# Altium schematic sheet LMS7_FE.SchDoc: XTRX. SDR mini PCIe Transceiver.
size A3; CompanyName: Fairwaves Inc.; DrawnBy: Andrey Sviyazov; Revision: 4; SheetNumber: 5; SheetTotal: 5
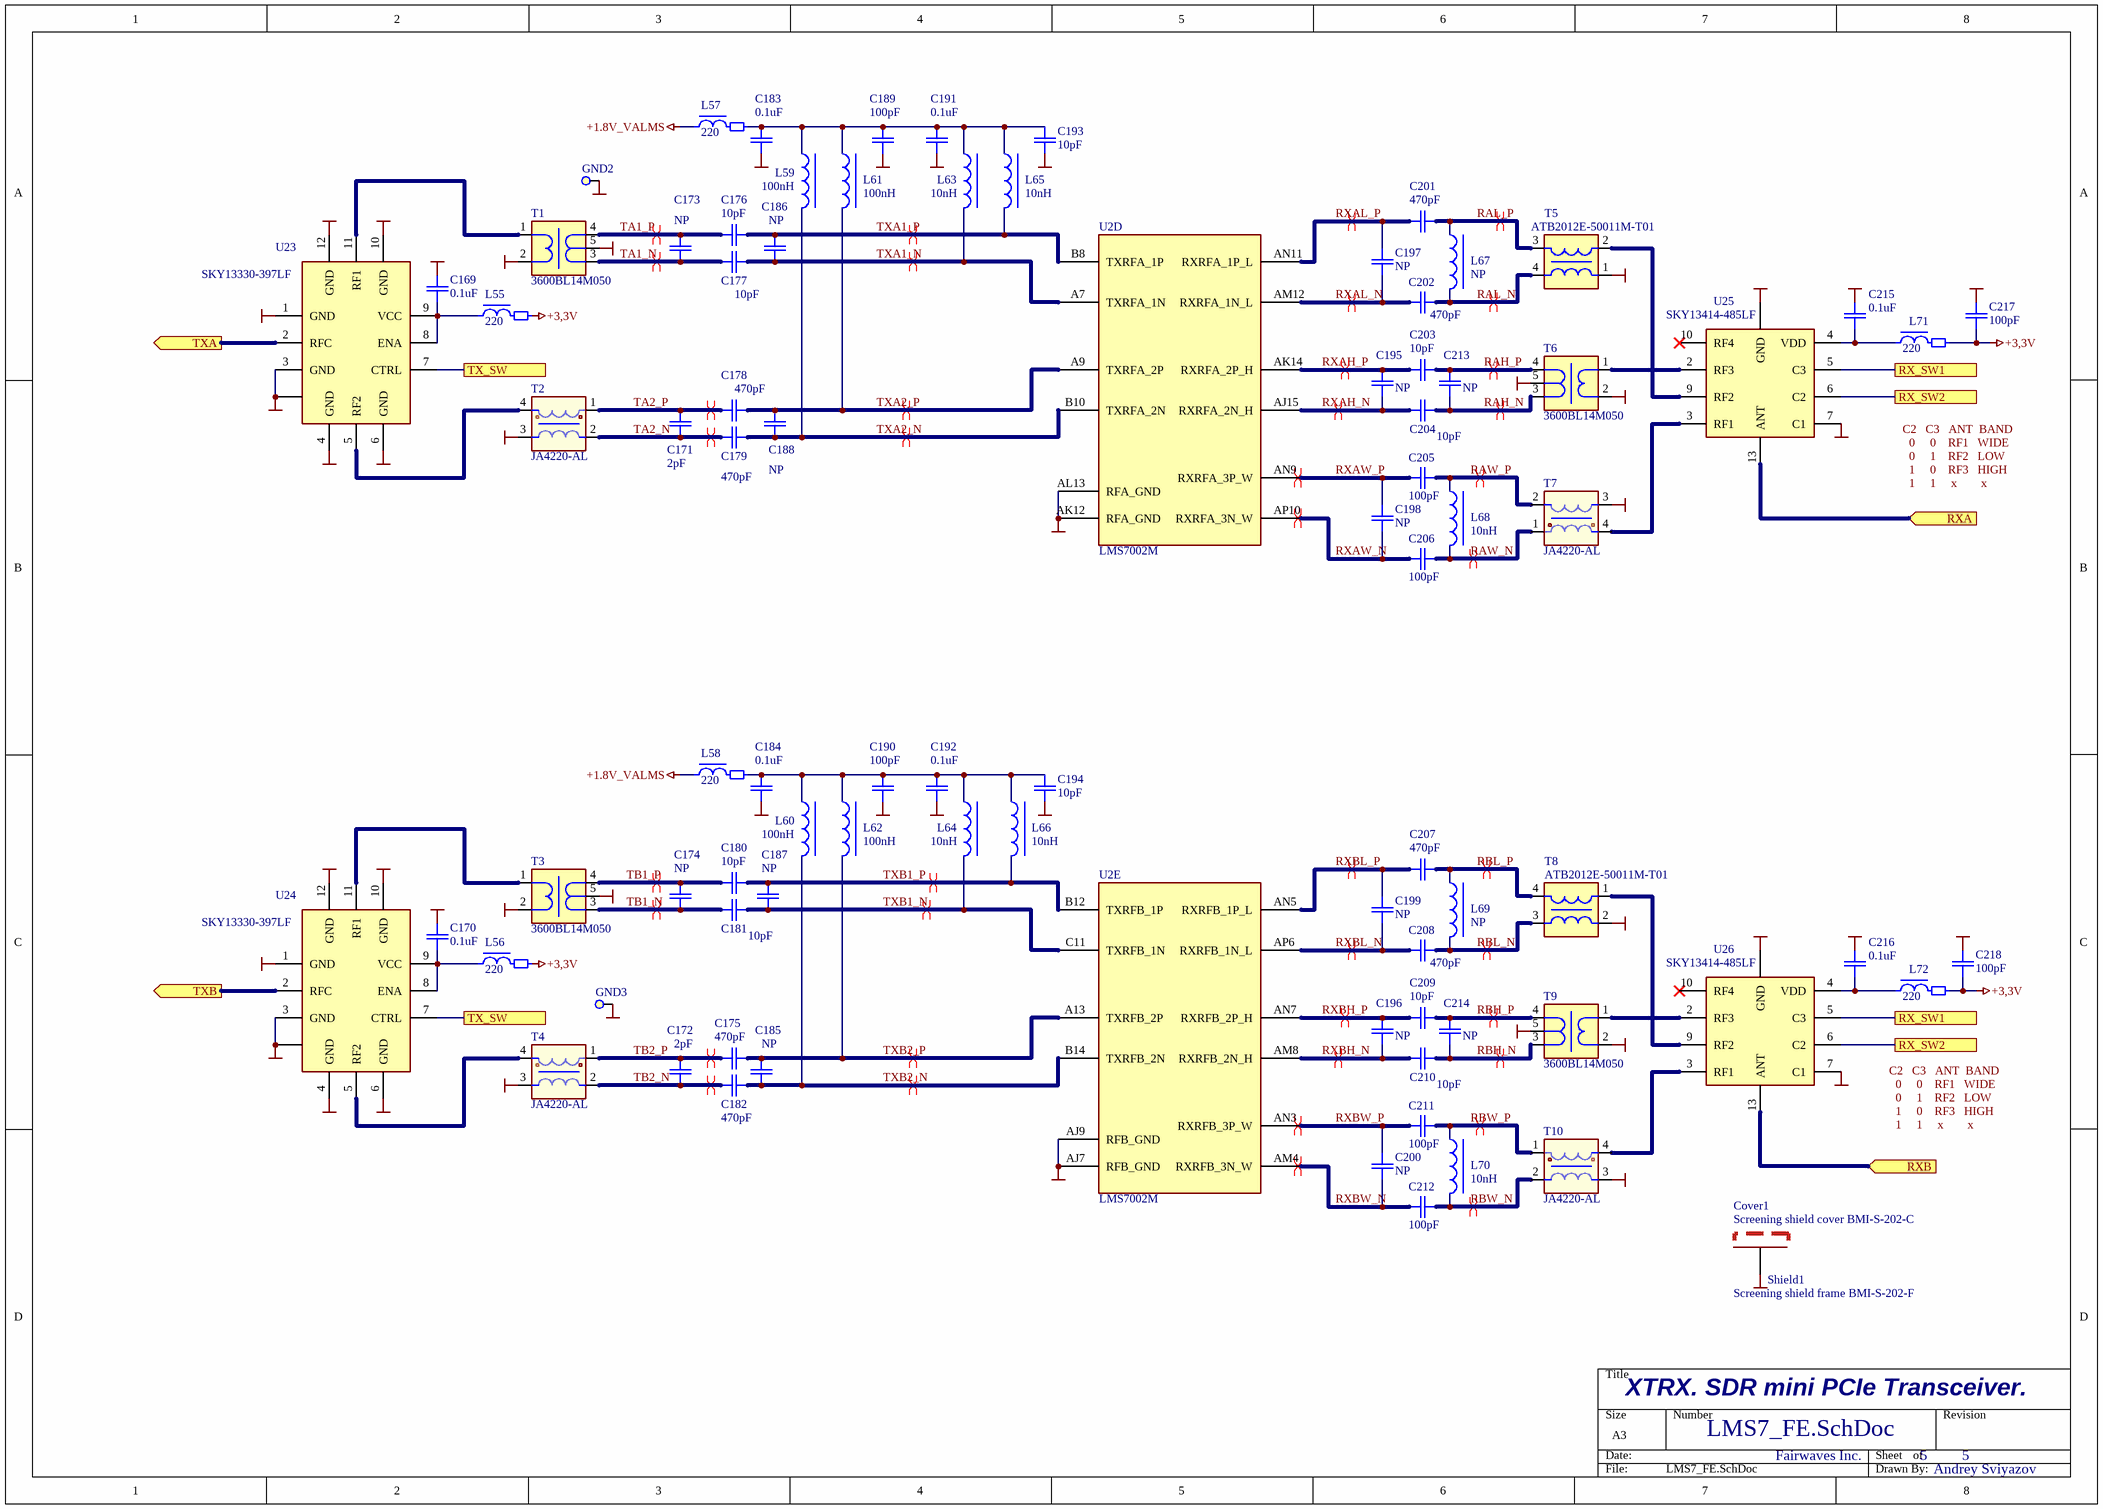
[diagram p0: LMS7_FE.SchDoc]

## Parts
C169  0.1uF  [C0402-cirq]
C170  0.1uF  [C0402-cirq]
C171  2pF  [C0402-cirq]
C172  2pF  [C0402-cirq]
C173  NP  [C0402-cirq]
C174  NP  [C0402-cirq]
C175  470pF  [C0402-cirq]
C176  10pF  [C0402-cirq]
C177  10pF  [C0402-cirq]
C178  470pF  [C0402-cirq]
C179  470pF  [C0402-cirq]
C180  10pF  [C0402-cirq]
C181  10pF  [C0402-cirq]
C182  470pF  [C0402-cirq]
C183  0.1uF  [C0402-cirq]
C184  0.1uF  [C0402-cirq]
C185  NP  [C0402-cirq]
C186  NP  [C0402-cirq]
C187  NP  [C0402-cirq]
C188  NP  [C0402-cirq]
C189  100pF  [C0402-cirq]
C190  100pF  [C0402-cirq]
C191  0.1uF  [C0402-cirq]
C192  0.1uF  [C0402-cirq]
C193  10pF  [C0402-cirq]
C194  10pF  [C0402-cirq]
C195  NP  [C0402-cirq]
C196  NP  [C0402-cirq]
C197  NP  [C0402-cirq]
C198  NP  [C0402-cirq]
C199  NP  [C0402-cirq]
C200  NP  [C0402-cirq]
C201  470pF  [C0402-cirq]
C202  470pF  [C0402-cirq]
C203  10pF  [C0402-cirq]
C204  10pF  [C0402-cirq]
C205  100pF  [C0402-cirq]
C206  100pF  [C0402-cirq]
C207  470pF  [C0402-cirq]
C208  470pF  [C0402-cirq]
C209  10pF  [C0402-cirq]
C210  10pF  [C0402-cirq]
C211  100pF  [C0402-cirq]
C212  100pF  [C0402-cirq]
C213  NP  [C0402-cirq]
C214  NP  [C0402-cirq]
C215  0.1uF  [C0402-cirq]
C216  0.1uF  [C0402-cirq]
C217  100pF  [C0402-cirq]
C218  100pF  [C0402-cirq]
Cover1  Screening shield cover BMI-S-202-C  (mechanical)
GND2  (no value)  [KP D1.5mm]  (no BOM)
GND3  (no value)  [KP D1.5mm]  (no BOM)
L55  220  [BEAD0402-Phillips]
L56  220  [BEAD0402-Phillips]
L57  220  [BEAD0402-Phillips]
L58  220  [BEAD0402-Phillips]
L59  100nH  [COIL0402-Phillips]
L60  100nH  [COIL0402-Phillips]
L61  100nH  [COIL0402-Phillips]
L62  100nH  [COIL0402-Phillips]
L63  10nH  [COIL0402-Phillips]
L64  10nH  [COIL0402-Phillips]
L65  10nH  [COIL0402-Phillips]
L66  10nH  [COIL0402-Phillips]
L67  NP  [COIL0402-Phillips]
L68  10nH  [COIL0402-Phillips]
L69  NP  [COIL0402-Phillips]
L70  10nH  [COIL0402-Phillips]
L71  220  [BEAD0402-Phillips]
L72  220  [BEAD0402-Phillips]
Shield1  Screening shield frame BMI-S-202-F  [BMI-S-202-F]
T1  3600BL14M050  [Balun 1.6x0.8x0.6mm]
T2  JA4220-AL  [JA4220-AL]
T3  3600BL14M050  [Balun 1.6x0.8x0.6mm]
T4  JA4220-AL  [JA4220-AL]
T5  ATB2012E-50011M-T01  [Balun 1.2x2x1mm]
T6  3600BL14M050  [Balun 1.6x0.8x0.6mm]
T7  JA4220-AL  [JA4220-AL]
T8  ATB2012E-50011M-T01  [Balun 1.2x2x1mm]
T9  3600BL14M050  [Balun 1.6x0.8x0.6mm]
T10  JA4220-AL  [JA4220-AL]
U2  LMS7002M  [aQFN260(11.5x11.5mm)]  (parts D,E of 5)
U23  SKY13330-397LF  [QFN12(2x2/0.5)]
U24  SKY13330-397LF  [QFN12(2x2/0.5)]
U25  SKY13414-485LF  [QFN14(2x2/0.4-0.45)]
U26  SKY13414-485LF  [QFN14(2x2/0.4-0.45)]

## Ports
RX_SW1, RX_SW2, RXA (in), RXB (in), TX_SW, TXA (out), TXB (out)

## Nets
+1.8V_VALMS: L57.1 L58.1
+3,3V: C217.1 C218.1 L55.2 L56.2 L71.2 L72.2
GND: C169.2 C170.2 C183.2 C184.2 C189.2 C190.2 C191.2 C192.2 C193.1 C194.1 C215.1 C216.1 C217.2 C218.2 GND2.1 GND3.1 Shield1.0(GND) T1.2 T1.5 T2.3(Pri) T3.2 T3.5 T4.3(Pri) T5.1 T6.2 T6.5 T7.3(Pri) T8.2 T9.2 T9.5 T10.3(Pri) U2.AJ7(RFB_GND) U2.AJ9(RFB_GND) U2.AK12(RFA_GND) U2.AL13(RFA_GND) U23.0 U23.1(GND) U23.3(GND) U23.4(GND) U23.6(GND) U23.10(GND) U23.12(GND) U24.0 U24.1(GND) U24.3(GND) U24.4(GND) U24.6(GND) U24.10(GND) U24.12(GND) U25.0(GND) U25.7(C1) U26.0(GND) U26.7(C1)
RAH_N: C204.2 C213.1 T6.3
RAH_P: C203.2 C213.2 T6.4
RAL_N: C202.1 L67.2 T5.4
RAL_P: C201.1 L67.1 T5.3
RAW_N: C206.2 L68.2 T7.1(Sec)
RAW_P: C205.2 L68.1 T7.2(Sec_Dot)
RBH_N: C210.2 C214.1 T9.3
RBH_P: C209.2 C214.2 T9.4
RBL_N: C208.1 L69.2 T8.3
RBL_P: C207.1 L69.1 T8.4
RBW_N: C212.2 L70.2 T10.2(Sec_Dot)
RBW_P: C211.2 L70.1 T10.1(Sec)
RX_SW1: U25.5(C3) U26.5(C3) ; port RX_SW1
RX_SW2: U25.6(C2) U26.6(C2) ; port RX_SW2
RXA: U25.13(ANT) ; port RXA
RXAH_N: C195.1 C204.1 U2.AJ15(RXRFA_2N_H)
RXAH_P: C195.2 C203.1 U2.AK14(RXRFA_2P_H)
RXAL_N: C197.1 C202.2 U2.AM12(RXRFA_1N_L)
RXAL_P: C197.2 C201.2 U2.AN11(RXRFA_1P_L)
RXAW_N: C198.1 C206.1 U2.AP10(RXRFA_3N_W)
RXAW_P: C198.2 C205.1 U2.AN9(RXRFA_3P_W)
RXB: U26.13(ANT) ; port RXB
RXBH_N: C196.1 C210.1 U2.AM8(RXRFB_2N_H)
RXBH_P: C196.2 C209.1 U2.AN7(RXRFB_2P_H)
RXBL_N: C199.1 C208.2 U2.AP6(RXRFB_1N_L)
RXBL_P: C199.2 C207.2 U2.AN5(RXRFB_1P_L)
RXBW_N: C200.2 C212.1 U2.AM4(RXRFB_3N_W)
RXBW_P: C200.1 C211.1 U2.AN3(RXRFB_3P_W)
TA1_N: C173.2 C177.1 T1.3
TA1_P: C173.1 C176.1 T1.4
TA2_N: C171.2 C179.2 T2.2(Sec_Dot)
TA2_P: C171.1 C178.2 T2.1(Sec)
TB1_N: C174.1 C181.1 T3.3
TB1_P: C174.2 C180.1 T3.4
TB2_N: C172.1 C182.2 T4.2(Sec_Dot)
TB2_P: C172.2 C175.2 T4.1(Sec)
TX_SW: U23.7(CTRL) U24.7(CTRL) ; port TX_SW
TXA: U23.2(RFC) ; port TXA
TXA1_N: C177.2 C186.2 L63.2 U2.A7(TXRFA_1N)
TXA1_P: C176.2 C186.1 L65.2 U2.B8(TXRFA_1P)
TXA2_N: C179.1 C188.2 L59.2 U2.B10(TXRFA_2N)
TXA2_P: C178.1 C188.1 L61.2 U2.A9(TXRFA_2P)
TXB: U24.2(RFC) ; port TXB
TXB1_N: C181.2 C187.1 L64.2 U2.C11(TXRFB_1N)
TXB1_P: C180.2 C187.2 L66.2 U2.B12(TXRFB_1P)
TXB2_N: C182.1 C185.1 L60.2 U2.B14(TXRFB_2N)
TXB2_P: C175.1 C185.2 L62.2 U2.A13(TXRFB_2P)
NetC169_1: C169.1 L55.1 U23.8(ENA) U23.9(VCC)
NetC170_1: C170.1 L56.1 U24.8(ENA) U24.9(VCC)
NetC183_1: C183.1 C189.1 C191.1 C193.2 L57.2 L59.1 L61.1 L63.1 L65.1
NetC184_1: C184.1 C190.1 C192.1 C194.2 L58.2 L60.1 L62.1 L64.1 L66.1
NetC215_2: C215.2 L71.1 U25.4(VDD)
NetC216_2: C216.2 L72.1 U26.4(VDD)
NetT1_1: T1.1 U23.11(RF1)
NetT2_4: T2.4(Pri_Dot) U23.5(RF2)
NetT3_1: T3.1 U24.11(RF1)
NetT4_4: T4.4(Pri_Dot) U24.5(RF2)
NetT5_2: T5.2 U25.9(RF2)
NetT6_1: T6.1 U25.2(RF3)
NetT7_4: T7.4(Pri_Dot) U25.3(RF1)
NetT8_1: T8.1 U26.9(RF2)
NetT9_1: T9.1 U26.2(RF3)
NetT10_4: T10.4(Pri_Dot) U26.3(RF1)

Not connected (* = marked no-connect by the designer): U25 10(RF4)*; U26 10(RF4)*

## Layout directives
differential pair: RAH_N, RAH_P, RAL_N, RAL_P, RAW_N, RAW_P, RBH_N, RBH_P, RBL_N, RBL_P, RBW_N, RBW_P, RXAH_N, RXAH_P, RXAL_N, RXAL_P, RXAW_N, RXAW_P, RXBH_N, RXBH_P, RXBL_N, RXBL_P, RXBW_N, RXBW_P, TA1_N, TA1_P, TA2_N, TA2_P, TB1_N, TB1_P, TB2_N, TB2_P, TXA1_N, TXA1_P, TXA2_N, TXA2_P, TXB1_N, TXB1_P, TXB2_N, TXB2_P

## Notes on the sheet
- C2   C3   ANT  BAND
- 0     0    RF1   WIDE
- 0     1    RF2   LOW
- 1     0    RF3   HIGH
- 1     1     x        x

## Library data of the parts
C169 C170 C183 C184 C191 C192 C215 C216 = C0402: Capacitor; Manufacturer: Any; Tolerance: 20%; Name: SMD0402; U/P/TKE: X7R 16V; Value: 0.1uF; Link: https://octopart.com/search?avg_avail=%281__%2A%29&q=GRM155+x7r+0.1uf+0402&r=sp&s=NUEPno7bQ4qfu1XPud9uDg&start=10
C171 C172 = C0402: Capacitor; Manufacturer: Any; Tolerance: 10%; Name: SMD0402; U/P/TKE: C0G 50V; Value: 2pF; Link: https://octopart.com/search?avg_avail=(1__*)&q=2pF%20%20C0G%20NP0%2050V%200402&start=0&specs2.76.numbers=2e-12&oq=2pF%20%20C0G%20NP0%2050V%200402
C173 C174 C185-C188 C195-C200 C213 C214 = C0402: Capacitor; Manufacturer: MURATA; Tolerance: 20%; Name: SMD0402; U/P/TKE: NP0; Value: NP
C175 C178 C179 C182 C201 C202 C207 C208 = C0402: Capacitor; Manufacturer: Any; Tolerance: 20%; Name: SMD0402; U/P/TKE: NP0 50V; Value: 470pF; Link: https://octopart.com/search?avg_avail=(1__*)&q=470pF%20%20C0G%20NP0%20%2050V%200402&start=0
C176 C177 C180 C181 C189 C190 C193 C194 C203-C206 C209-C212 C217 C218 = C0402: Capacitor; Manufacturer: Any; Tolerance: 20%; Name: SMD0402; U/P/TKE: C0G 50V
  C176 C177 C180 C181 C193 C194 C203 C204 C209 C210: Value: 10pF; Link: https://octopart.com/search?avg_avail=(1__*)&q=10pF%20%20C0G%20NP0%20%2050V%200402&start=0
  C189 C190 C205 C206 C211 C212 C217 C218: Value: 100pF; Link: https://octopart.com/search?avg_avail=(1__*)&q=100pF%20%20C0G%20NP0%20%2050V%200402&start=0&oq=100pF%20%20C0G%20NP0%20%2050V%200402
Cover1 = Screen cover BMI-S-202-C: Screening shield cover; Manufacturer: Laird Tech; Name: Screening shield cover BMI-S-202-C; Link: https://octopart.com/bmi-s-202-c-laird-19008953
GND2 GND3 = KP-D1.5mm: Manufacturer: PCB
L55-L58 L71 L72 = EMI BLM15: Ferrite bead EMIFIL; Manufacturer: MURATA; Name: BLM15EG221SN1; Value: 220; Link: https://octopart.com/blm15eg221sn1d-murata-368376
L59-L62 = L-LQW15: Coil wire wound; Manufacturer: MuRata; Tolerance: ±5%; Name: LQW15ANR10J00D; Value: 100nH; Link: https://octopart.com/lqw15anr10j00d-murata-387640
L63-L66 L68 L70 = L-LQW15: Coil wire wound; Manufacturer: MuRata; Tolerance: ±5%; Name: LQW15AN10NJ00D; Value: 10nH; Link: https://octopart.com/lqw15an10nj00d-murata-387450
L67 L69 = L-LQW15: Coil wire wound; Manufacturer: MuRata; Tolerance: ±5%; Value: NP
Shield1 = Screen frame BMI-S-202-F: Screening shield frame; Manufacturer: Laird Tech; Name: Screening shield frame BMI-S-202-F; Link: https://octopart.com/bmi-s-202-f-laird-19008954
T1 T3 T6 T9 = Balun 3-4GHz: Balun bal-unbal; Manufacturer: Johanson Technology, Inc.; Name: Balun 50/50 3-4 GHz; Value: 3600BL14M050; Link: https://octopart.com/3600bl14m050t-johanson-11760610
T2 T4 T7 T10 = Balun JA4220-AL: Balun; Manufacturer: Coilcraft; Misc: RF 1:1 Balun 50 Ohm, h 3mm; Name: JA4220-AL; Link: https://octopart.com/ja4220-al-coilcraft-30564806
T5 T8 = Balun ATB2012: Balun bal-unbal; Manufacturer: TDK; Name: Balun wirewound 50/50, 0.04-1 GHz; Value: ATB2012E-50011M-T01; Link: https://octopart.com/atb2012e-50011m-t01-tdk-38835046
U2 = LMS7002M: IC FPRF MIMO Transceiver; Manufacturer: Lime Microsystems; Misc: Multi-band Multi-standard  Transceiver with Digital Interface; Name: LMS7002M
U23 U24 = SKY13330-397LF: IC RF Switch; Manufacturer: Skyworks; Misc: SP4T 0.-6 GHz RF Switch; Swap: No; U/P/TKE: 2.3-4.8V; Name: SKY13330-397LF; Link: https://octopart.com/sky13330-397lf-skyworks+solutions-19662969
U25 U26 = SKY13414-485LF: IC RF SP4T Switch; Manufacturer: Skyworks; Misc: SP4T 0.1-3.8 GHz RF Switch, No caps; Swap: No; U/P/TKE: Vcc 2.5-4.8V/Vcont 1.35-2.7V; Name: SKY13414-485LF; Link: https://octopart.com/search?q=SKY13414-485LF